# EAGLE design MAXM86161 (EAGLE 9.6.2)
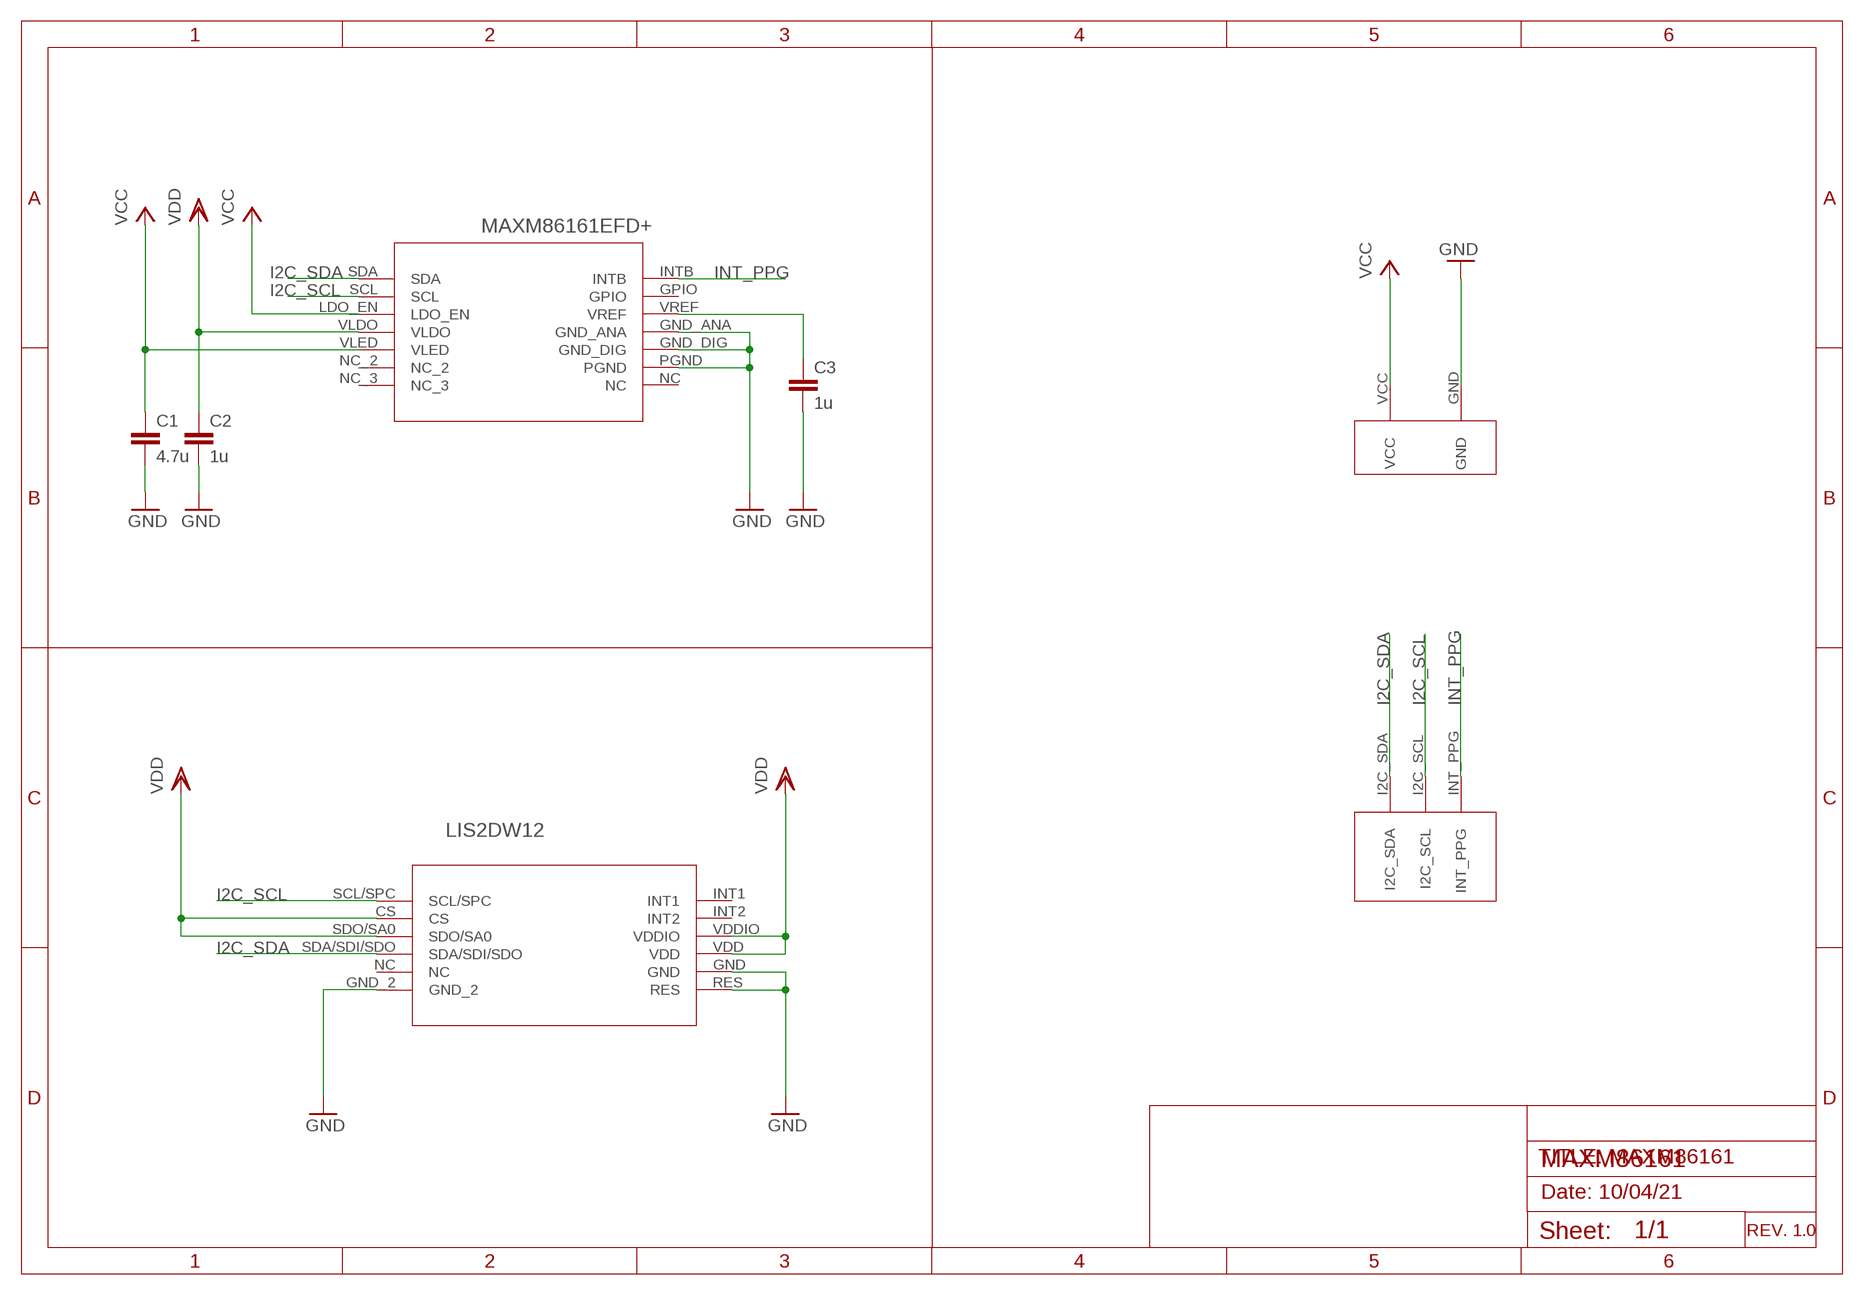
[diagram p0: schematic, sheet 1]
FRAME1 (A4L-LOC): DATE_TIME: Date: 10/04/21; REV: REV. 1.0; TITLE: TITLE: MAXM86161

## Parts
C1  4.7u  C0603  [C0603]
C2  1u  C0402  [C0402]
C3  1u  C0402  [C0402]
U1  MAXM86161EFD+  [21-100309A_MXM]
U2  LIS2DW12  [LIS2DW12_LGA-12_2X2X0P7_STM]
U$1  PAD_2  [PAD_2]
U$2  PAD_3  [PAD_3]

## Nets
GND: C1.P$2 C2.P$2 C3.P$2 U1.GND_ANA U1.GND_DIG U1.PGND U2.GND U2.GND_2 U2.RES U$1.GND
I2C_SCL: U1.SCL U2.SCL/SPC U$2.I2C_SCL
I2C_SDA: U1.SDA U2.SDA/SDI/SDO U$2.I2C_SDA
INT_PPG: U1.INTB U$2.INT_PPG
N$1: C3.P$1 U1.VREF
VCC: C1.P$1 U1.LDO_EN U1.VLED U$1.VCC
VDD: C2.P$1 U1.VLDO U2.CS U2.SDO/SA0 U2.VDD U2.VDDIO
Unconnected: U1.GPIO U1.NC U1.NC_2 U1.NC_3 U2.INT1 U2.INT2 U2.NC

## Library data of the parts
C1-C3 = 221e_passives:C
U1 = MAXM86161:MAXM86161EFD+; BUILT_BY: EMA_Rebekah; COPYRIGHT: Copyright (C) 2018 Accelerated Designs. All rights reserved; MANUFACTURER_PART_NUMBER: MAXM86161EFD+; SOURCELIBRARY: Maxim_2019-09-13; VENDOR: Maxim Integrated Products
U2 = LIS2DW12:LIS2DW12
U$1 = PADS:PAD_2: PADs
U$2 = PADS:PAD_3

## Board
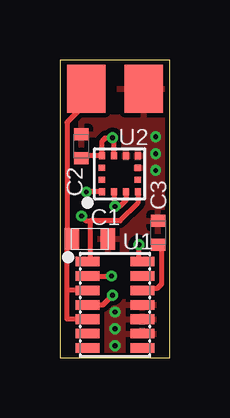
[diagram p1: board, top side]
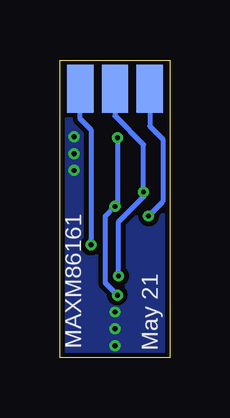
[diagram p2: board, bottom side, seen from below]

Size 4.6 x 12.4 mm. Coordinates in mm from the lower left corner, seen from the top.
Outline: 0,0 4.6,0 4.6,12.4 0,12.4 0,0
Copper layers (1*16): Top 0.035mm / dielectric 1.6mm / Bottom 0.035mm
Design rules "jlcpcb_stackup_2layer *": minimum track width 0.2mm, minimum drill 0.2mm, track to track 0.2mm, track to pad 0.2mm, pad to pad 0.2mm, via to via 0.2mm, smd to smd 0.2mm, copper to edge 0.2mm, drill to drill 0.2mm, minimum pad ring 0.2mm, minimum via ring 5mil, stop-mask expansion 0.035mm, vias tented up to drill 0.5mm, thermal gap 0.2mm
tRestrict: 8 lines

### Footprints (pad centres in the part's own frame; a part is rotated, then mirrored left to right if it is on the bottom)
C0603 = smd 0.6 x 0.9: P$1 -0.75,0; P$2 0.75,0
C0402 = smd 0.5 x 0.6: P$1 -0.5,0; P$2 0.5,0
21-100309A_MXM = smd 1 x 0.4: GND_ANA 1.15,0; GND_DIG 1.15,-0.6; GPIO 1.15,1.2; INTB 1.15,1.8; LDO_EN -1.15,0.6; NC 1.15,-1.8; NC_2 -1.15,-1.2; NC_3 -1.15,-1.8; PGND 1.15,-1.2; SCL -1.15,1.2; SDA -1.15,1.8; VLDO -1.15,0; VLED -1.15,-0.6; VREF 1.15,0.6
LIS2DW12_LGA-12_2X2X0P7_STM = smd 0.275 x 0.25: CS -0.75,0.25; GND 0.75,-0.25; RES 0.75,-0.75; SCL/SPC -0.75,0.75; SDA/SDI/SDO -0.75,-0.75; SDO/SA0 -0.75,-0.25; VDD 0.75,0.25; VDDIO 0.75,0.75 | smd 0.25 x 0.275: GND_2 0.25,-0.75; INT1 -0.25,0.75; INT2 0.25,0.75; NC -0.25,-0.75
PAD_2 = smd 1.6 x 2: GND 1.2,1.2; VCC -1.2,1.2
PAD_3 = smd 1.1 x 2: I2C_SCL 0,1.2; I2C_SDA 1.45,1.2; INT_PPG -1.45,1.2

### Placement (x,y rotation side)
C1  1.25,4.95 0 top
C2  0.9,8.8 90 top
C3  4.1,5.2 90 top
U1  2.3,2.2 0 top
U2  2.5,7.66 90 top
U$1  2.3,10 0 top
U$2  2.3,10 0 bottom

### Tracks (layer width: path | path; a pad name or v marks a point on that pad's centre or on a via)
GND  (via drill 0.2)
  other vias: 2.3,0.5 2.3,1.2 4,8.5 4,7.8 4,9.2 2.3,1.9
  pour Bottom: 0,12.4 0,0 4.6,0 4.6,12.4
  pour Top: 0,12.4 0,0 4.6,0 4.6,12.4
I2C_SCL  (via drill 0.2)
  Top 0.2: U1.SCL v2.15,3.4 | U2.SCL/SPC v1.12,6.91 v1.11,6.9
  Bottom 0.2: v2.15,3.4 2.15,5.66 1.11,6.7 v1.11,6.9 1.11,8.88 2.3,10.07 U$2.I2C_SCL
I2C_SDA  (via drill 0.2)
  Top 0.2: U2.SDA/SDI/SDO 3.25,6.43 2.52,5.7 1.25,5.7 | 1.25,5.7 1.25,4.1 U1.SDA | v0.9,5.9 1.1,5.7 1.25,5.7
  Bottom 0.2: U$2.I2C_SDA 0.85,9.65 0.3,9.1 0.3,6.5 v0.9,5.9
INT_PPG  (via drill 0.2)
  Top 0.2: U1.INTB 3.3,4.15 v3.3,4.7
  Bottom 0.2: v3.3,4.7 3.3,9.5 3.75,9.95 U$2.INT_PPG
N$1
  Top 0.2: U1.VREF 3.55,2.9 4.07,2.9 4.25,3.08 4.25,4.55 C3.P$1
VCC
  Top 0.2: U1.VLED 0.3,1.6 0.3,2.8 | U1.LDO_EN 0.3,2.8 | U$1.VCC 1.1,10.6 0.3,9.8 0.3,4.77 | 0.3,2.8 0.3,4.77 | 0.3,4.77 C1.P$1
VDD  (via drill 0.2)
  Top 0.2: v2.2,2.6 1.8,2.2 U1.VLDO | U2.SDO/SA0 2.75,6.55 2.5,6.3 v2.3,6.3 2.25,6.35 U2.CS | U2.VDD 2.25,9.11 v2.2,9.16 1.9,9.16 1.75,9.01 U2.VDDIO 1.01,8.41 C2.P$1
  Bottom 0.2: v2.2,2.6 2.7,3.1 2.7,5.9 v2.3,6.3 2.2,6.4 v2.2,9.16

### Text on the board
bNames: MAXM86161 | May 21